# EAGLE schematic e4 (EAGLE 6.1)
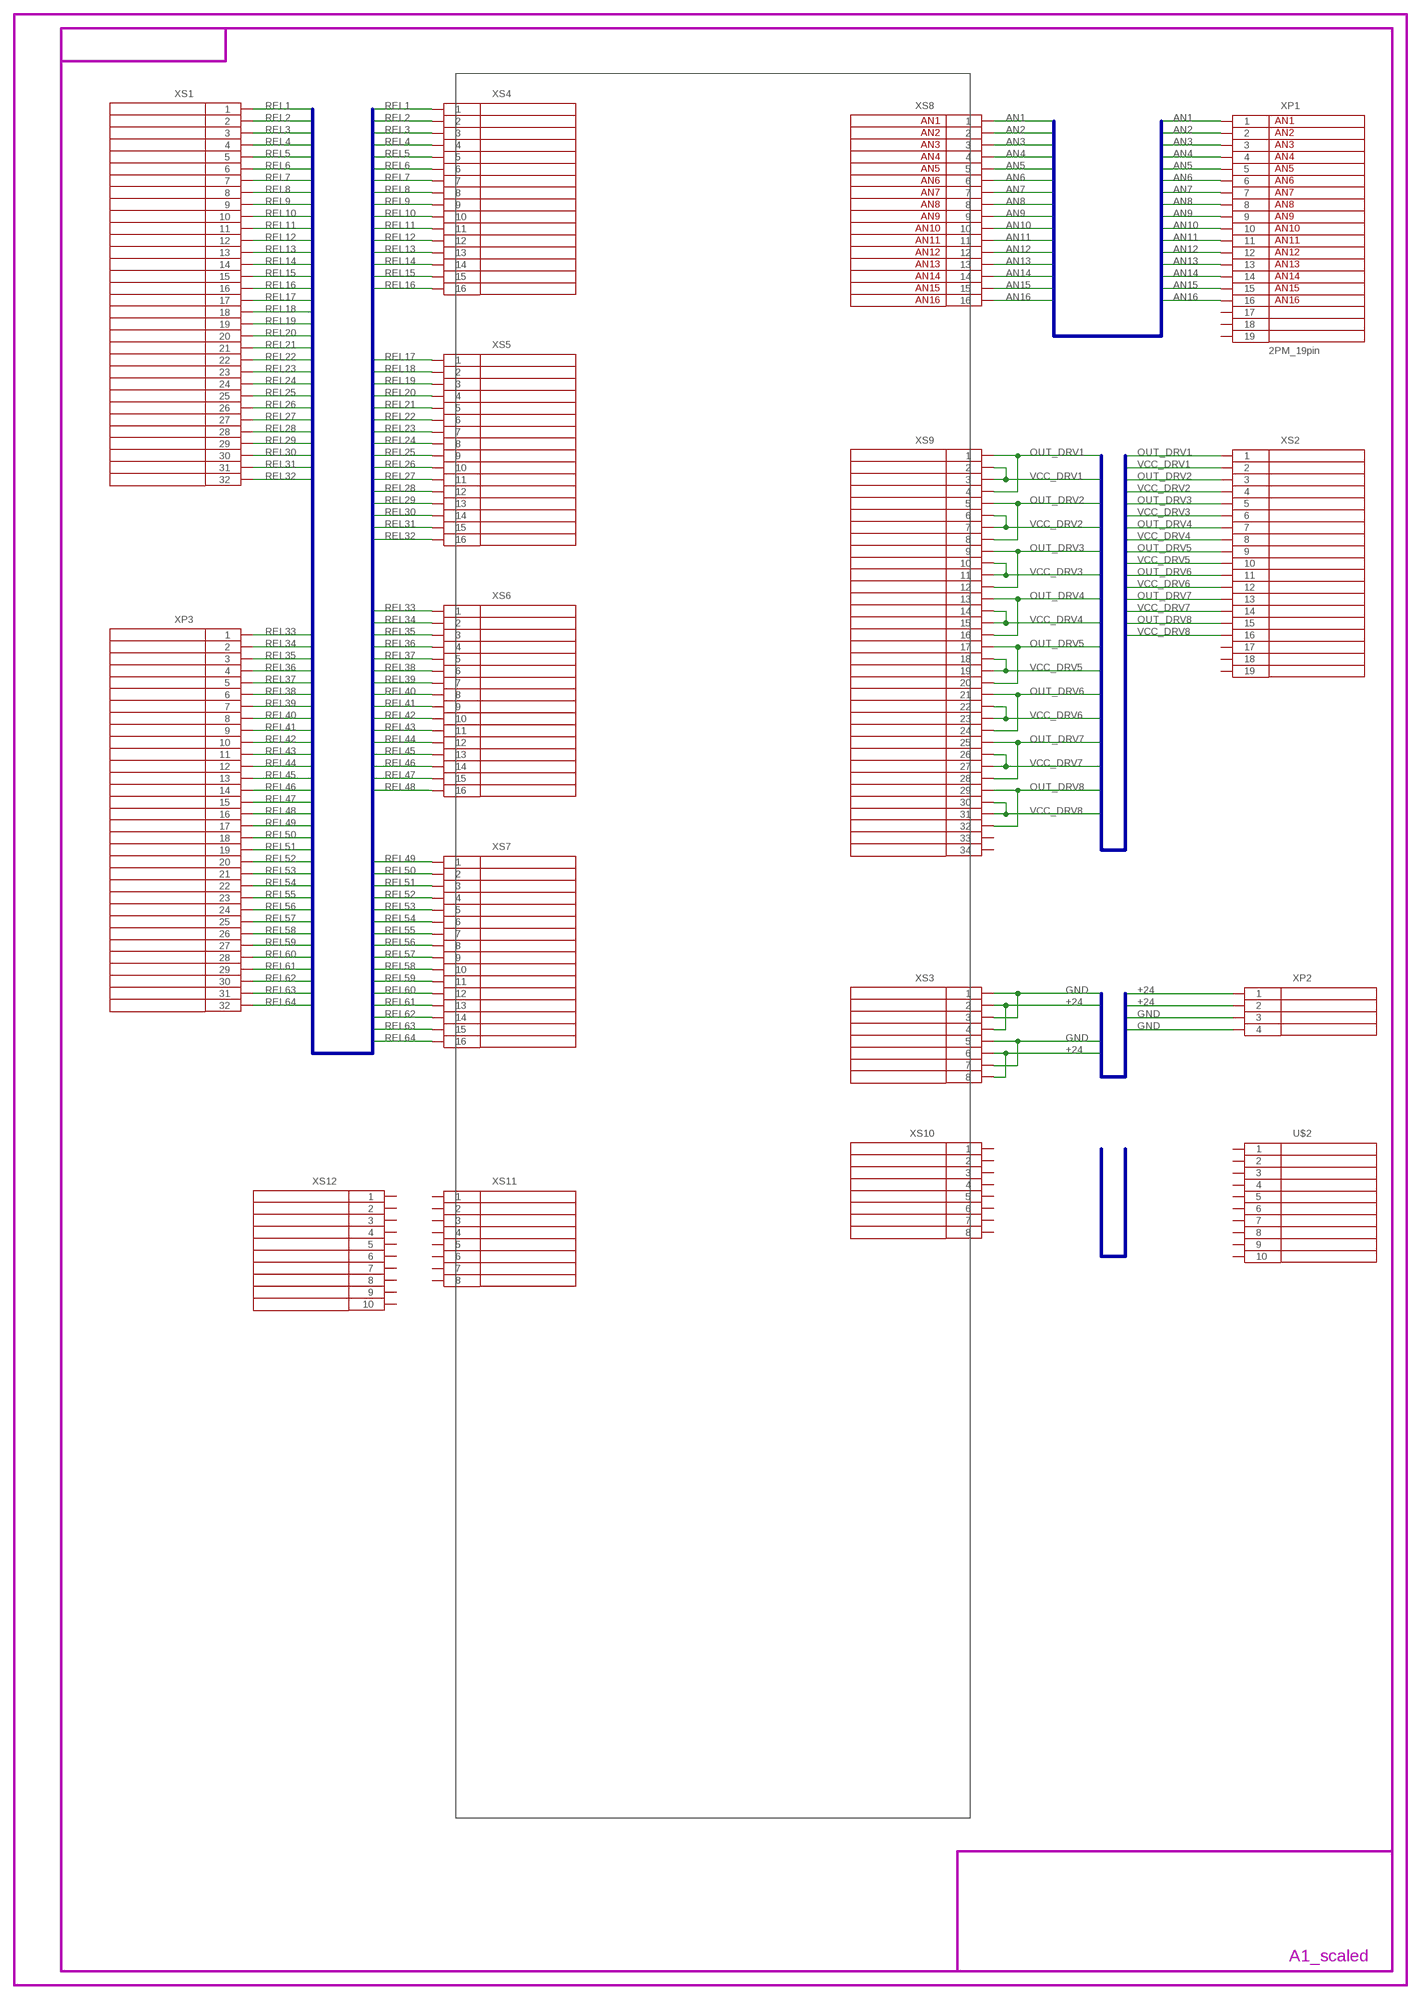
[diagram p0: schematic, sheet 1]

## Parts
U$2  GENERIC_10_XP  [FAKE]
XP1  2PM_19pin  GENERIC_19_XP  [FAKE]
XP2  GENERIC_04_XP  [FAKE]
XP3  GENERIC_32_XP  [FAKE]
XS1  GENERIC_32_XS  [FAKE]
XS2  GENERIC_19_XS  [FAKE]
XS3  GENERIC_08_XS  [FAKE]
XS4  GENERIC_16_XS  [FAKE]
XS5  GENERIC_16_XS  [FAKE]
XS6  GENERIC_16_XS  [FAKE]
XS7  GENERIC_16_XS  [FAKE]
XS8  GENERIC_16_XS  [FAKE]
XS9  GENERIC_34_XS  [FAKE]
XS10  GENERIC_08_XS  [FAKE]
XS11  GENERIC_08_XS  [FAKE]
XS12  GENERIC_10_XS  [FAKE]

## Nets
+24: XP2.1 XP2.2 XS3.2 XS3.4 XS3.6 XS3.8
AN1: XS8.1
AN2: XS8.2
AN3: XS8.3
AN4: XS8.4
AN5: XS8.5
AN6: XS8.6
AN7: XS8.7
AN8: XS8.8
AN9: XS8.9
AN10: XS8.10
AN11: XS8.11
AN12: XS8.12
AN13: XS8.13
AN14: XS8.14
AN15: XS8.15
AN16: XS8.16
GND: XP2.3 XP2.4 XS3.1 XS3.3 XS3.5 XS3.7
OUT_DRV1: XS2.1 XS9.1 XS9.4
OUT_DRV2: XS2.3 XS9.5 XS9.8
OUT_DRV3: XS2.5 XS9.9 XS9.12
OUT_DRV4: XS2.7 XS9.13 XS9.16
OUT_DRV5: XS2.9 XS9.17 XS9.20
OUT_DRV6: XS2.11 XS9.21 XS9.24
OUT_DRV7: XS2.13 XS9.25 XS9.28
OUT_DRV8: XS2.15 XS9.29 XS9.32
REL1: XS1.1 XS4.1
REL2: XS1.2 XS4.2
REL3: XS1.3 XS4.3
REL4: XS1.4 XS4.4
REL5: XS1.5 XS4.5
REL6: XS1.6 XS4.6
REL7: XS1.7 XS4.7
REL8: XS1.8 XS4.8
REL9: XS1.9 XS4.9
REL10: XS1.10 XS4.10
REL11: XS1.11 XS4.11
REL12: XS1.12 XS4.12
REL13: XS1.13 XS4.13
REL14: XS1.14 XS4.14
REL15: XS1.15 XS4.15
REL16: XS1.16 XS4.16
REL17: XS1.17 XS5.1
REL18: XS1.18 XS5.2
REL19: XS1.19 XS5.3
REL20: XS1.20 XS5.4
REL21: XS1.21 XS5.5
REL22: XS1.22 XS5.6
REL23: XS1.23 XS5.7
REL24: XS1.24 XS5.8
REL25: XS1.25 XS5.9
REL26: XS1.26 XS5.10
REL27: XS1.27 XS5.11
REL28: XS1.28 XS5.12
REL29: XS1.29 XS5.13
REL30: XS1.30 XS5.14
REL31: XS1.31 XS5.15
REL32: XS1.32 XS5.16
REL33: XP3.1 XS6.1
REL34: XP3.2 XS6.2
REL35: XP3.3 XS6.3
REL36: XP3.4 XS6.4
REL37: XP3.5 XS6.5
REL38: XP3.6 XS6.6
REL39: XP3.7 XS6.7
REL40: XP3.8 XS6.8
REL41: XP3.9 XS6.9
REL42: XP3.10 XS6.10
REL43: XP3.11 XS6.11
REL44: XP3.12 XS6.12
REL45: XP3.13 XS6.13
REL46: XP3.14 XS6.14
REL47: XP3.15 XS6.15
REL48: XP3.16 XS6.16
REL49: XP3.17 XS7.1
REL50: XP3.18 XS7.2
REL51: XP3.19 XS7.3
REL52: XP3.20 XS7.4
REL53: XP3.21 XS7.5
REL54: XP3.22 XS7.6
REL55: XP3.23 XS7.7
REL56: XP3.24 XS7.8
REL57: XP3.25 XS7.9
REL58: XP3.26 XS7.10
REL59: XP3.27 XS7.11
REL60: XP3.28 XS7.12
REL61: XP3.29 XS7.13
REL62: XP3.30 XS7.14
REL63: XP3.31 XS7.15
REL64: XP3.32 XS7.16
VCC_DRV1: XS2.2 XS9.2 XS9.3
VCC_DRV2: XS2.4 XS9.6 XS9.7
VCC_DRV3: XS2.6 XS9.10 XS9.11
VCC_DRV4: XS2.8 XS9.14 XS9.15
VCC_DRV5: XS2.10 XS9.18 XS9.19
VCC_DRV6: XS2.12 XS9.22 XS9.23
VCC_DRV7: XS2.14 XS9.26 XS9.27
VCC_DRV8: XS2.16 XS9.30 XS9.31
Unconnected: U$2.1 U$2.2 U$2.3 U$2.4 U$2.5 U$2.6 U$2.7 U$2.8 U$2.9 U$2.10 XP1.1 XP1.2 XP1.3 XP1.4 XP1.5 XP1.6 XP1.7 XP1.8 XP1.9 XP1.10 XP1.11 XP1.12 XP1.13 XP1.14 XP1.15 XP1.16 XP1.17 XP1.18 XP1.19 XS2.17 XS2.18 XS2.19 XS9.33 XS9.34 XS10.1 XS10.2 XS10.3 XS10.4 XS10.5 XS10.6 XS10.7 XS10.8 XS11.1 XS11.2 XS11.3 XS11.4 XS11.5 XS11.6 XS11.7 XS11.8 XS12.1 XS12.2 XS12.3 XS12.4 XS12.5 XS12.6 XS12.7 XS12.8 XS12.9 XS12.10

## Buses
AN[1..16]
REL[1..64]
OUT_DRV[1..8],VCC_DRV[1..8]
+24,GND
B$1

## Notes on the sheet
- AN1 | AN1
- AN2 | AN2
- AN3 | AN3
- AN4 | AN4
- AN5 | AN5
- AN6 | AN6
- AN7 | AN7
- AN8 | AN8
- AN9 | AN9
- AN10 | AN10
- AN11 | AN11
- AN12 | AN12
- AN13 | AN13
- AN14 | AN14
- AN15 | AN15
- AN16 | AN16

## Library data of the parts
U$2 = connector:GENERIC_10_XP
XP1 = connector:GENERIC_19_XP
XP2 = connector:GENERIC_04_XP
XP3 = connector:GENERIC_32_XP
XS1 = connector:GENERIC_32_XS
XS2 = connector:GENERIC_19_XS
XS3 XS10 XS11 = connector:GENERIC_08_XS
XS4-XS8 = connector:GENERIC_16_XS
XS9 = connector:GENERIC_34_XS
XS12 = connector:GENERIC_10_XS